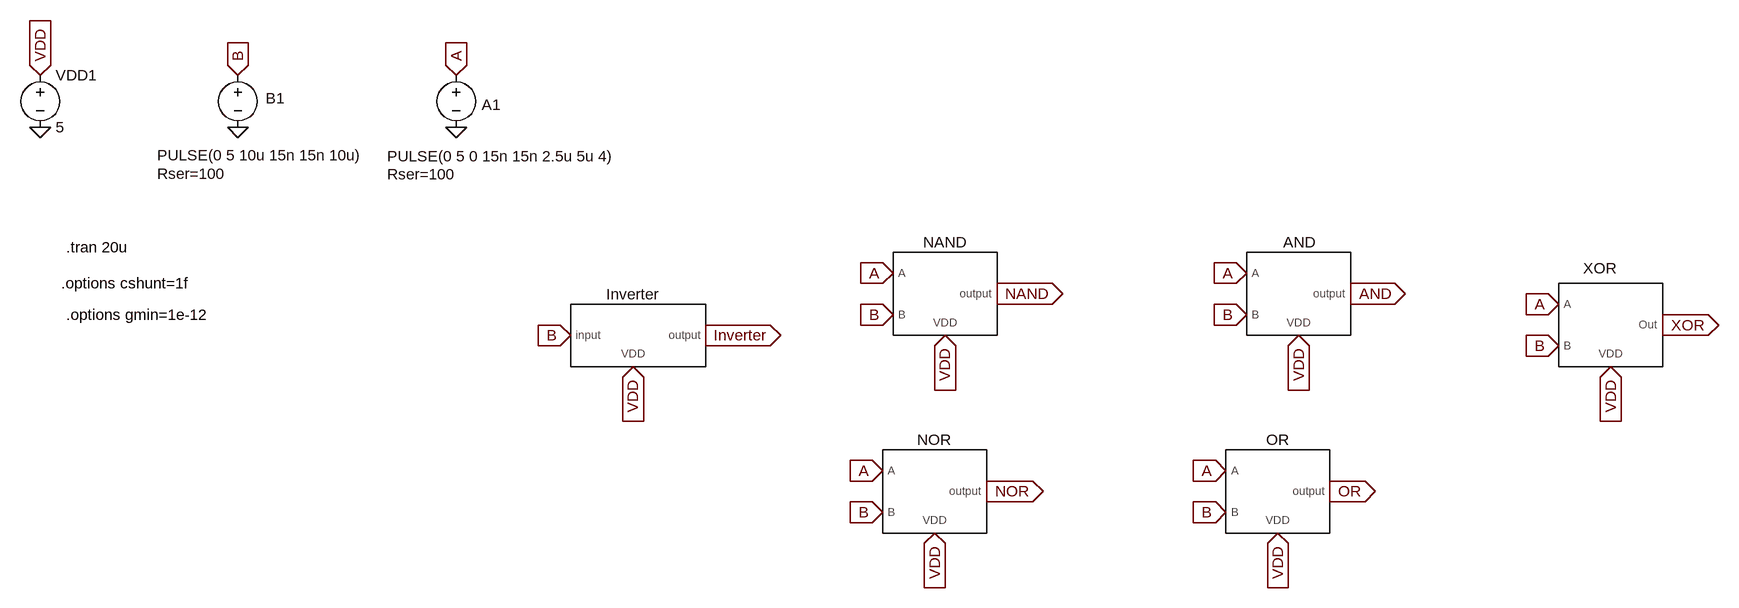
[diagram p0: schematic Component Test.asc]
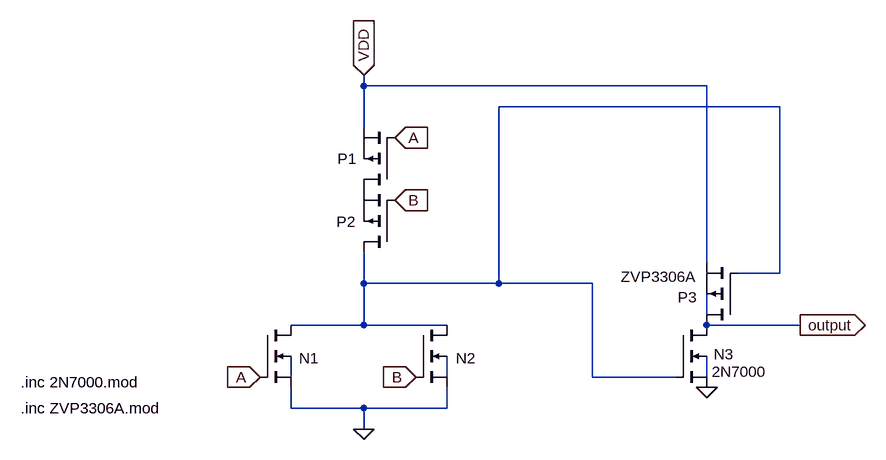
[diagram p1: sub-circuit and.asc]
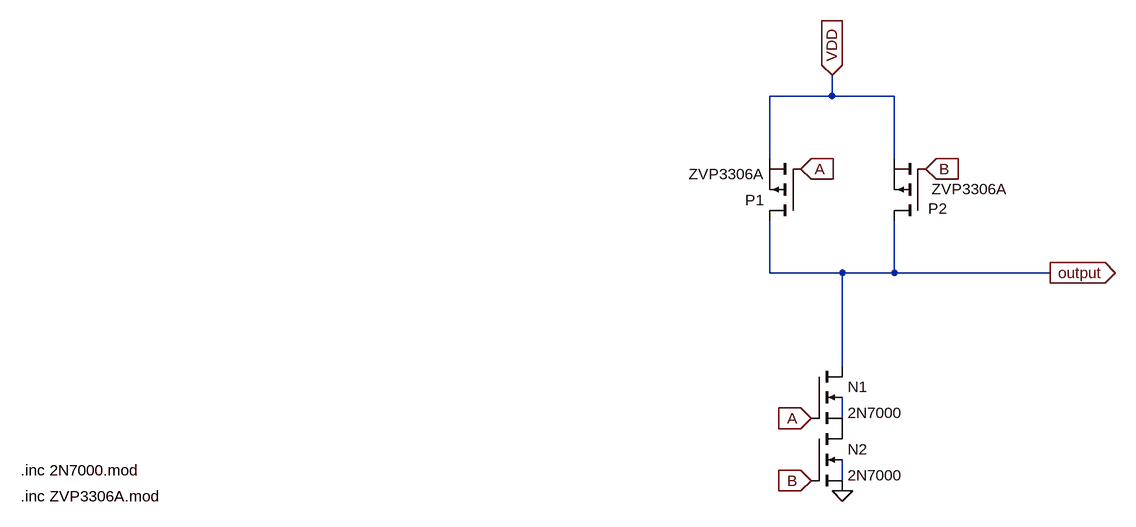
[diagram p2: sub-circuit nand.asc]
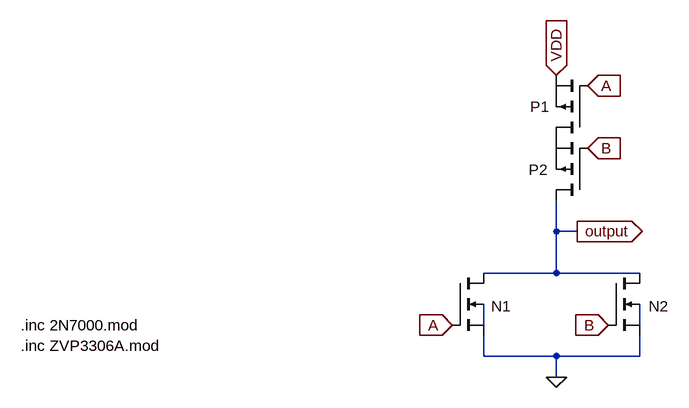
[diagram p3: sub-circuit nor.asc]
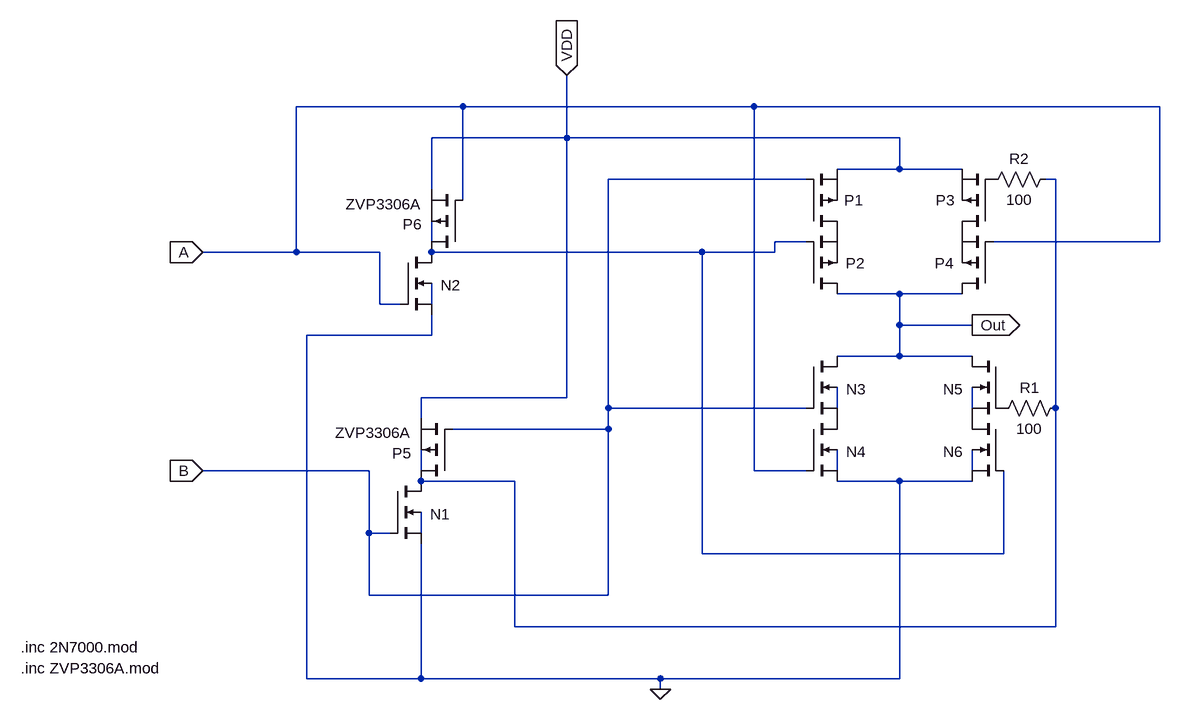
[diagram p4: sub-circuit xor.asc]
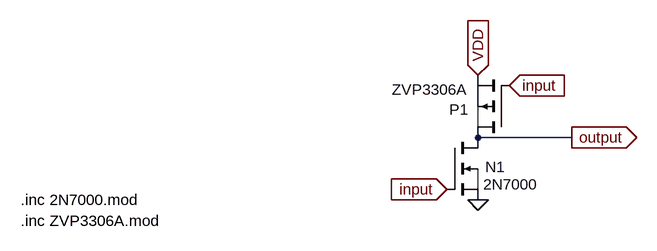
[diagram p5: sub-circuit inverter.asc]
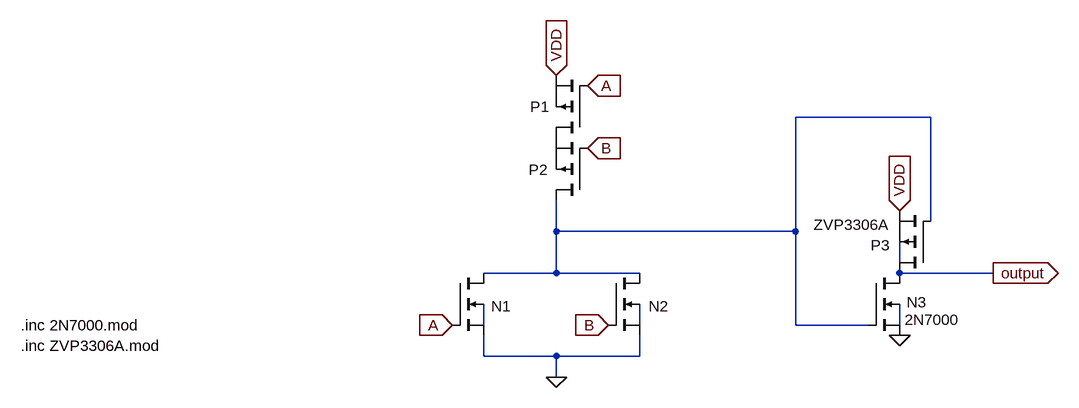
[diagram p6: sub-circuit or.asc]
Component Test.asc, the LTspice schematic file:
Version 4.1
SHEET 1 1416 1008
FLAG 160 512 NAND
IOPIN 160 512 Out
FLAG 144 816 NOR
IOPIN 144 816 Out
FLAG 704 512 AND
IOPIN 704 512 Out
FLAG 1184 560 XOR
IOPIN 1184 560 Out
FLAG -288 576 Inverter
IOPIN -288 576 Out
FLAG -496 576 B
IOPIN -496 576 In
FLAG 0 480 A
IOPIN 0 480 In
FLAG -16 784 A
IOPIN -16 784 In
FLAG 544 480 A
IOPIN 544 480 In
FLAG 1024 528 A
IOPIN 1024 528 In
FLAG 544 544 B
IOPIN 544 544 In
FLAG 1024 592 B
IOPIN 1024 592 In
FLAG 0 544 B
IOPIN 0 544 In
FLAG -16 848 B
IOPIN -16 848 In
FLAG 80 576 VDD
IOPIN 80 576 In
FLAG 64 880 VDD
IOPIN 64 880 In
FLAG 624 576 VDD
IOPIN 624 576 In
FLAG 1104 624 VDD
IOPIN 1104 624 In
FLAG -672 176 A
IOPIN -672 176 In
FLAG -672 256 0
FLAG -1008 176 B
IOPIN -1008 176 In
FLAG -1008 256 0
FLAG -1312 176 VDD
IOPIN -1312 176 In
FLAG -1312 256 0
FLAG -400 624 VDD
IOPIN -400 624 In
FLAG 512 848 B
IOPIN 512 848 In
FLAG 512 784 A
IOPIN 512 784 In
FLAG 592 880 VDD
IOPIN 592 880 In
FLAG 672 816 OR
IOPIN 672 816 Out
SYMBOL CMOS\ Logic\ Gates\\AND 624 496 R0
SYMATTR InstName AND
SYMBOL CMOS\ Logic\ Gates\\NAND 80 512 R0
SYMATTR InstName NAND
SYMBOL CMOS\ Logic\ Gates\\NOR 64 800 R0
SYMATTR InstName NOR
SYMBOL CMOS\ Logic\ Gates\\XOR 1088 544 R0
SYMATTR InstName XOR
SYMBOL voltage -672 160 R0
WINDOW 0 39 61 Left 2
WINDOW 3 -106 140 Left 2
WINDOW 123 0 0 Left 0
WINDOW 39 -106 168 Left 2
SYMATTR InstName A1
SYMATTR Value PULSE(0 5 0 15n 15n 2.5u 5u 4)
SYMATTR SpiceLine Rser=100
SYMBOL voltage -1008 160 R0
WINDOW 0 43 51 Left 2
WINDOW 3 -124 139 Left 2
WINDOW 123 0 0 Left 0
WINDOW 39 -124 167 Left 2
SYMATTR InstName B1
SYMATTR Value PULSE(0 5 10u 15n 15n 10u)
SYMATTR SpiceLine Rser=100
SYMBOL voltage -1312 160 R0
WINDOW 123 0 0 Left 0
WINDOW 39 0 0 Left 0
SYMATTR InstName VDD1
SYMATTR Value 5
SYMBOL CMOS\ Logic\ Gates\\Inverter -400 576 R0
SYMATTR InstName Inverter
SYMBOL CMOS\ Logic\ Gates\\OR 576 800 R0
SYMATTR InstName OR
TEXT -1272 440 Left 2 !.tran 20u
TEXT -1280 496 Left 2 !.options cshunt=1f
TEXT -1272 544 Left 2 !.options gmin=1e-12

and.asc, the sub-circuit schematic file:
Version 4.1
SHEET 1 880 680
WIRE -48 -112 -48 -128
WIRE 480 -112 -48 -112
WIRE 592 -80 160 -80
WIRE -48 -48 -48 -112
WIRE 480 160 480 -112
WIRE 592 176 592 -80
WIRE 592 176 528 176
WIRE -48 192 -48 144
WIRE 160 192 160 -80
WIRE 160 192 -48 192
WIRE 304 192 160 192
WIRE 480 240 480 208
WIRE -48 256 -48 192
WIRE -48 256 -160 256
WIRE 80 256 -48 256
WIRE 624 256 480 256
WIRE -160 336 -160 304
WIRE 80 336 80 304
WIRE 304 336 304 192
WIRE 432 336 304 336
WIRE 480 336 480 304
WIRE -160 384 -160 352
WIRE -48 384 -160 384
WIRE 80 384 80 352
WIRE 80 384 -48 384
WIRE -48 416 -48 384
FLAG -48 416 0
FLAG -48 -128 VDD
IOPIN -48 -128 In
FLAG 0 -32 A
IOPIN 0 -32 In
FLAG -208 336 A
IOPIN -208 336 In
FLAG 0 64 B
IOPIN 0 64 In
FLAG 32 336 B
IOPIN 32 336 In
FLAG 480 352 0
FLAG 624 256 output
IOPIN 624 256 Out
SYMBOL nmos4 -208 256 R0
WINDOW 0 60 51 Left 2
WINDOW 3 56 72 Invisible 2
SYMATTR InstName N1
SYMATTR Value 2N7000
SYMATTR Prefix X
SYMBOL pmos 0 48 R180
WINDOW 0 59 48 Left 2
WINDOW 3 56 72 Invisible 2
SYMATTR InstName P1
SYMATTR Value ZVP3306A
SYMATTR Prefix X
SYMBOL nmos4 32 256 R0
WINDOW 0 62 51 Left 2
WINDOW 3 56 72 Invisible 2
SYMATTR InstName N2
SYMATTR Value 2N7000
SYMATTR Prefix X
SYMBOL pmos 0 144 R180
WINDOW 0 61 47 Left 2
WINDOW 3 56 72 Invisible 2
SYMATTR InstName P2
SYMATTR Value ZVP3306A
SYMATTR Prefix X
SYMBOL nmos4 432 256 R0
WINDOW 0 59 45 Left 2
SYMATTR InstName N3
SYMATTR Value 2N7000
SYMATTR Prefix X
SYMBOL pmos 528 256 R180
WINDOW 0 63 43 Left 2
WINDOW 3 64 74 Left 2
SYMATTR InstName P3
SYMATTR Value ZVP3306A
SYMATTR Prefix X
TEXT -576 344 Left 2 !.inc 2N7000.mod
TEXT -576 384 Left 2 !.inc ZVP3306A.mod

nand.asc, the sub-circuit schematic file:
Version 4.1
SHEET 1 1872 680
WIRE 768 -208 768 -240
WIRE 768 -208 672 -208
WIRE 864 -208 768 -208
WIRE 672 -112 672 -208
WIRE 864 -112 864 -208
WIRE 672 64 672 -16
WIRE 784 64 672 64
WIRE 864 64 864 -16
WIRE 864 64 784 64
WIRE 1104 64 864 64
WIRE 784 208 784 64
WIRE 784 288 784 256
WIRE 784 384 784 352
FLAG 784 400 0
FLAG 768 -240 VDD
IOPIN 768 -240 In
FLAG 1104 64 output
IOPIN 1104 64 Out
FLAG 720 -96 A
IOPIN 720 -96 In
FLAG 736 288 A
IOPIN 736 288 In
FLAG 912 -96 B
IOPIN 912 -96 In
FLAG 736 384 B
IOPIN 736 384 In
SYMBOL pmos 720 -16 R180
SYMATTR InstName P1
SYMATTR Value ZVP3306A
SYMATTR Prefix X
SYMBOL nmos4 736 304 R0
SYMATTR InstName N2
SYMATTR Value 2N7000
SYMATTR Prefix X
SYMBOL pmos 912 -16 R180
WINDOW 0 -33 19 Left 2
WINDOW 3 -126 49 Left 2
SYMATTR InstName P2
SYMATTR Value ZVP3306A
SYMATTR Prefix X
SYMBOL nmos4 736 208 R0
SYMATTR InstName N1
SYMATTR Value 2N7000
SYMATTR Prefix X
TEXT -480 368 Left 2 !.inc 2N7000.mod
TEXT -480 408 Left 2 !.inc ZVP3306A.mod

nor.asc, the sub-circuit schematic file:
Version 4.1
SHEET 1 1280 680
WIRE 816 144 816 96
WIRE 848 144 816 144
WIRE 816 208 816 144
WIRE 816 208 704 208
WIRE 944 208 816 208
WIRE 704 288 704 256
WIRE 944 288 944 256
WIRE 704 336 704 304
WIRE 816 336 704 336
WIRE 944 336 944 304
WIRE 944 336 816 336
WIRE 816 368 816 336
FLAG 816 368 0
FLAG 816 -96 VDD
IOPIN 816 -96 In
FLAG 848 144 output
IOPIN 848 144 Out
FLAG 864 -80 A
IOPIN 864 -80 In
FLAG 656 288 A
IOPIN 656 288 In
FLAG 864 16 B
IOPIN 864 16 In
FLAG 896 288 B
IOPIN 896 288 In
SYMBOL nmos4 656 208 R0
WINDOW 0 60 51 Left 2
WINDOW 3 56 72 Invisible 2
SYMATTR InstName N1
SYMATTR Value 2N7000
SYMATTR Prefix X
SYMBOL pmos 864 0 R180
WINDOW 0 59 48 Left 2
WINDOW 3 56 72 Invisible 2
SYMATTR InstName P1
SYMATTR Value ZVP3306A
SYMATTR Prefix X
SYMBOL nmos4 896 208 R0
WINDOW 0 62 51 Left 2
WINDOW 3 56 72 Invisible 2
SYMATTR InstName N2
SYMATTR Value 2N7000
SYMATTR Prefix X
SYMBOL pmos 864 96 R180
WINDOW 0 61 47 Left 2
WINDOW 3 56 72 Invisible 2
SYMATTR InstName P2
SYMATTR Value ZVP3306A
SYMATTR Prefix X
TEXT -8 288 Left 2 !.inc 2N7000.mod
TEXT -8 320 Left 2 !.inc ZVP3306A.mod

xor.asc, the sub-circuit schematic file:
Version 4.1
SHEET 1 1140 708
WIRE 64 -208 -192 -208
WIRE 512 -208 64 -208
WIRE 1136 -208 512 -208
WIRE 224 -160 224 -256
WIRE 224 -160 16 -160
WIRE 736 -160 224 -160
WIRE 736 -112 736 -160
WIRE 736 -112 640 -112
WIRE 832 -112 736 -112
WIRE 592 -96 288 -96
WIRE 976 -96 960 -96
WIRE 16 -80 16 -160
WIRE 64 -64 64 -208
WIRE 16 0 16 -32
WIRE 592 0 544 0
WIRE 1136 0 1136 -208
WIRE 1136 0 880 0
WIRE -192 16 -192 -208
WIRE -192 16 -336 16
WIRE -64 16 -192 16
WIRE 432 16 16 16
WIRE 544 16 544 0
WIRE 544 16 432 16
WIRE 736 80 640 80
WIRE 832 80 736 80
WIRE -64 96 -64 16
WIRE -32 96 -64 96
WIRE 16 96 16 64
WIRE 736 128 736 80
WIRE 848 128 736 128
WIRE 16 144 16 112
WIRE 16 144 -176 144
WIRE 736 176 736 128
WIRE 736 176 640 176
WIRE 848 176 736 176
WIRE 224 240 224 -160
WIRE 224 240 0 240
WIRE 288 256 288 -96
WIRE 592 256 288 256
WIRE 640 256 640 224
WIRE 848 256 848 224
WIRE 976 256 976 -96
WIRE 0 272 0 240
WIRE 288 288 288 256
WIRE 288 288 48 288
WIRE -80 352 -336 352
WIRE 0 352 0 320
WIRE 512 352 512 -208
WIRE 592 352 512 352
WIRE 640 352 640 320
WIRE 848 352 848 320
WIRE 144 368 0 368
WIRE 736 368 640 368
WIRE 848 368 736 368
WIRE -80 448 -80 352
WIRE -48 448 -80 448
WIRE 0 448 0 416
WIRE 432 480 432 16
WIRE 896 480 896 352
WIRE 896 480 432 480
WIRE -80 544 -80 448
WIRE 288 544 288 288
WIRE 288 544 -80 544
WIRE 144 592 144 368
WIRE 976 592 976 256
WIRE 976 592 144 592
WIRE -176 672 -176 144
WIRE 0 672 0 464
WIRE 0 672 -176 672
WIRE 368 672 0 672
WIRE 736 672 736 368
WIRE 736 672 368 672
WIRE 368 688 368 672
FLAG 848 128 Out
IOPIN 848 128 Out
FLAG -336 352 B
IOPIN -336 352 In
FLAG -336 16 A
IOPIN -336 16 In
FLAG 224 -256 VDD
IOPIN 224 -256 In
FLAG 368 688 0
SYMBOL pmos 592 -16 M180
WINDOW 0 59 48 Left 2
WINDOW 3 56 72 Invisible 2
SYMATTR InstName P1
SYMATTR Value ZVP3306A
SYMATTR Prefix X
SYMBOL pmos 592 80 M180
WINDOW 0 61 47 Left 2
WINDOW 3 56 72 Invisible 2
SYMATTR InstName P2
SYMATTR Value ZVP3306A
SYMATTR Prefix X
SYMBOL pmos 880 -16 R180
WINDOW 0 59 48 Left 2
WINDOW 3 56 72 Invisible 2
SYMATTR InstName P3
SYMATTR Value ZVP3306A
SYMATTR Prefix X
SYMBOL pmos 880 80 R180
WINDOW 0 61 47 Left 2
WINDOW 3 56 72 Invisible 2
SYMATTR InstName P4
SYMATTR Value ZVP3306A
SYMATTR Prefix X
SYMBOL pmos 48 368 R180
WINDOW 0 63 43 Left 2
WINDOW 3 64 74 Left 2
SYMATTR InstName P5
SYMATTR Value ZVP3306A
SYMATTR Prefix X
SYMBOL pmos 64 16 R180
WINDOW 0 63 43 Left 2
WINDOW 3 64 74 Left 2
SYMATTR InstName P6
SYMATTR Value ZVP3306A
SYMATTR Prefix X
SYMBOL res 992 240 R90
WINDOW 0 0 56 VBottom 2
WINDOW 3 32 56 VTop 2
SYMATTR InstName R1
SYMATTR Value 100
SYMBOL res 976 -112 R90
WINDOW 0 0 56 VBottom 2
WINDOW 3 32 56 VTop 2
SYMATTR InstName R2
SYMATTR Value 100
SYMBOL nmos4 -48 368 R0
WINDOW 0 62 51 Left 2
WINDOW 3 56 72 Invisible 2
SYMATTR InstName N1
SYMATTR Value 2N7000
SYMATTR Prefix X
SYMBOL nmos4 -32 16 R0
WINDOW 0 62 51 Left 2
WINDOW 3 56 72 Invisible 2
SYMATTR InstName N2
SYMATTR Value 2N7000
SYMATTR Prefix X
SYMBOL nmos4 592 176 R0
WINDOW 0 62 51 Left 2
WINDOW 3 56 72 Invisible 2
SYMATTR InstName N3
SYMATTR Value 2N7000
SYMATTR Prefix X
SYMBOL nmos4 592 272 R0
WINDOW 0 62 51 Left 2
WINDOW 3 56 72 Invisible 2
SYMATTR InstName N4
SYMATTR Value 2N7000
SYMATTR Prefix X
SYMBOL nmos4 896 176 M0
WINDOW 0 62 51 Left 2
WINDOW 3 56 72 Invisible 2
SYMATTR InstName N5
SYMATTR Value 2N7000
SYMATTR Prefix X
SYMBOL nmos4 896 272 M0
WINDOW 0 62 51 Left 2
WINDOW 3 56 72 Invisible 2
SYMATTR InstName N6
SYMATTR Value 2N7000
SYMATTR Prefix X
TEXT -616 624 Left 2 !.inc 2N7000.mod
TEXT -616 656 Left 2 !.inc ZVP3306A.mod

inverter.asc, the sub-circuit schematic file:
Version 4.1
SHEET 1 1152 680
WIRE 496 208 496 176
WIRE 640 224 496 224
WIRE 496 304 496 272
FLAG 496 320 0
FLAG 544 144 input
IOPIN 544 144 In
FLAG 448 304 input
IOPIN 448 304 In
FLAG 640 224 output
IOPIN 640 224 Out
FLAG 496 128 VDD
IOPIN 496 128 In
SYMBOL nmos4 448 224 R0
WINDOW 0 59 45 Left 2
SYMATTR InstName N1
SYMATTR Value 2N7000
SYMATTR Prefix X
SYMBOL pmos 544 224 R180
WINDOW 0 63 43 Left 2
WINDOW 3 64 74 Left 2
SYMATTR InstName P1
SYMATTR Value ZVP3306A
SYMATTR Prefix X
TEXT -208 320 Left 2 !.inc 2N7000.mod
TEXT -208 352 Left 2 !.inc ZVP3306A.mod

or.asc, the sub-circuit schematic file:
Version 4.1
SHEET 1 1624 680
WIRE 1392 -16 1184 -16
WIRE 1392 144 1392 -16
WIRE 816 160 816 112
WIRE 1184 160 1184 -16
WIRE 1184 160 816 160
WIRE 1344 208 1344 176
WIRE 816 224 816 160
WIRE 816 224 704 224
WIRE 944 224 816 224
WIRE 1488 224 1344 224
WIRE 704 304 704 272
WIRE 944 304 944 272
WIRE 1184 304 1184 160
WIRE 1296 304 1184 304
WIRE 1344 304 1344 272
WIRE 704 352 704 320
WIRE 816 352 704 352
WIRE 944 352 944 320
WIRE 944 352 816 352
WIRE 816 384 816 352
FLAG 816 384 0
FLAG 816 -80 VDD
IOPIN 816 -80 In
FLAG 864 -64 A
IOPIN 864 -64 In
FLAG 656 304 A
IOPIN 656 304 In
FLAG 864 32 B
IOPIN 864 32 In
FLAG 896 304 B
IOPIN 896 304 In
FLAG 1344 320 0
FLAG 1488 224 output
IOPIN 1488 224 Out
FLAG 1344 128 VDD
IOPIN 1344 128 In
SYMBOL nmos4 656 224 R0
WINDOW 0 60 51 Left 2
WINDOW 3 56 72 Invisible 2
SYMATTR InstName N1
SYMATTR Value 2N7000
SYMATTR Prefix X
SYMBOL pmos 864 16 R180
WINDOW 0 59 48 Left 2
WINDOW 3 56 72 Invisible 2
SYMATTR InstName P1
SYMATTR Value ZVP3306A
SYMATTR Prefix X
SYMBOL nmos4 896 224 R0
WINDOW 0 62 51 Left 2
WINDOW 3 56 72 Invisible 2
SYMATTR InstName N2
SYMATTR Value 2N7000
SYMATTR Prefix X
SYMBOL pmos 864 112 R180
WINDOW 0 61 47 Left 2
WINDOW 3 56 72 Invisible 2
SYMATTR InstName P2
SYMATTR Value ZVP3306A
SYMATTR Prefix X
SYMBOL nmos4 1296 224 R0
WINDOW 0 59 45 Left 2
SYMATTR InstName N3
SYMATTR Value 2N7000
SYMATTR Prefix X
SYMBOL pmos 1392 224 R180
WINDOW 0 63 43 Left 2
WINDOW 3 64 74 Left 2
SYMATTR InstName P3
SYMATTR Value ZVP3306A
SYMATTR Prefix X
TEXT -8 304 Left 2 !.inc 2N7000.mod
TEXT -8 336 Left 2 !.inc ZVP3306A.mod

The netlist it stands for:
* Component Test.asc
X§AND A B VDD AND and
X§NAND A B VDD NAND nand
X§NOR A B VDD NOR nor
X§XOR A B VDD XOR xor
V§A1 A 0 PULSE(0 5 0 15n 15n 2.5u 5u 4) Rser=100
V§B1 B 0 PULSE(0 5 10u 15n 15n 10u) Rser=100
VDD1 VDD 0 5
X§Inverter B VDD Inverter inverter
X§OR A B VDD OR or

* block symbol definitions
.subckt and A B VDD output
X§N1 N001 A 0 N003 2N7000  ; pins D G S B
X§P1 P001 A VDD ZVP3306A  ; pins D G S
X§N2 N001 B 0 N004 2N7000  ; pins D G S B
X§P2 N001 B P001 ZVP3306A  ; pins D G S
X§N3 output N001 0 N005 2N7000  ; pins D G S B
X§P3 output N001 VDD ZVP3306A  ; pins D G S
.inc 2N7000.mod
.inc ZVP3306A.mod
.ends and

.subckt nand A B VDD output
X§P1 output A VDD ZVP3306A  ; pins D G S
X§N2 P001 B 0 N002 2N7000  ; pins D G S B
X§P2 output B VDD ZVP3306A  ; pins D G S
X§N1 output A P001 N001 2N7000  ; pins D G S B
.inc 2N7000.mod
.inc ZVP3306A.mod
.ends nand

.subckt nor A B VDD output
X§N1 output A 0 N001 2N7000  ; pins D G S B
X§P1 P001 A VDD ZVP3306A  ; pins D G S
X§N2 output B 0 N002 2N7000  ; pins D G S B
X§P2 output B P001 ZVP3306A  ; pins D G S
.inc 2N7000.mod
.inc ZVP3306A.mod
.ends nor

.subckt xor A B VDD Out
X§P1 P001 B VDD ZVP3306A  ; pins D G S
X§P2 Out N003 P001 ZVP3306A  ; pins D G S
X§P3 P002 P003 VDD ZVP3306A  ; pins D G S
X§P4 Out A P002 ZVP3306A  ; pins D G S
X§P5 N001 B VDD ZVP3306A  ; pins D G S
X§P6 N003 A VDD ZVP3306A  ; pins D G S
R1 N001 P004 100
R2 N001 P003 100
X§N1 N001 B 0 N010 2N7000  ; pins D G S B
X§N2 N003 A 0 N004 2N7000  ; pins D G S B
X§N3 Out B P005 N005 2N7000  ; pins D G S B
X§N4 P005 A 0 N008 2N7000  ; pins D G S B
X§N5 Out P004 P006 N006 2N7000  ; pins D G S B
X§N6 P006 N003 0 N009 2N7000  ; pins D G S B
.inc 2N7000.mod
.inc ZVP3306A.mod
.ends xor

.subckt inverter input VDD output
X§N1 output input 0 N002 2N7000  ; pins D G S B
X§P1 output input VDD ZVP3306A  ; pins D G S
.inc 2N7000.mod
.inc ZVP3306A.mod
.ends inverter

.subckt or A B VDD output
X§N1 N001 A 0 N003 2N7000  ; pins D G S B
X§P1 P001 A VDD ZVP3306A  ; pins D G S
X§N2 N001 B 0 N004 2N7000  ; pins D G S B
X§P2 N001 B P001 ZVP3306A  ; pins D G S
X§N3 output N001 0 N005 2N7000  ; pins D G S B
X§P3 output N001 VDD ZVP3306A  ; pins D G S
.inc 2N7000.mod
.inc ZVP3306A.mod
.ends or

.tran 20u
.options cshunt=1f
.options gmin=1e-12
.backanno
.end